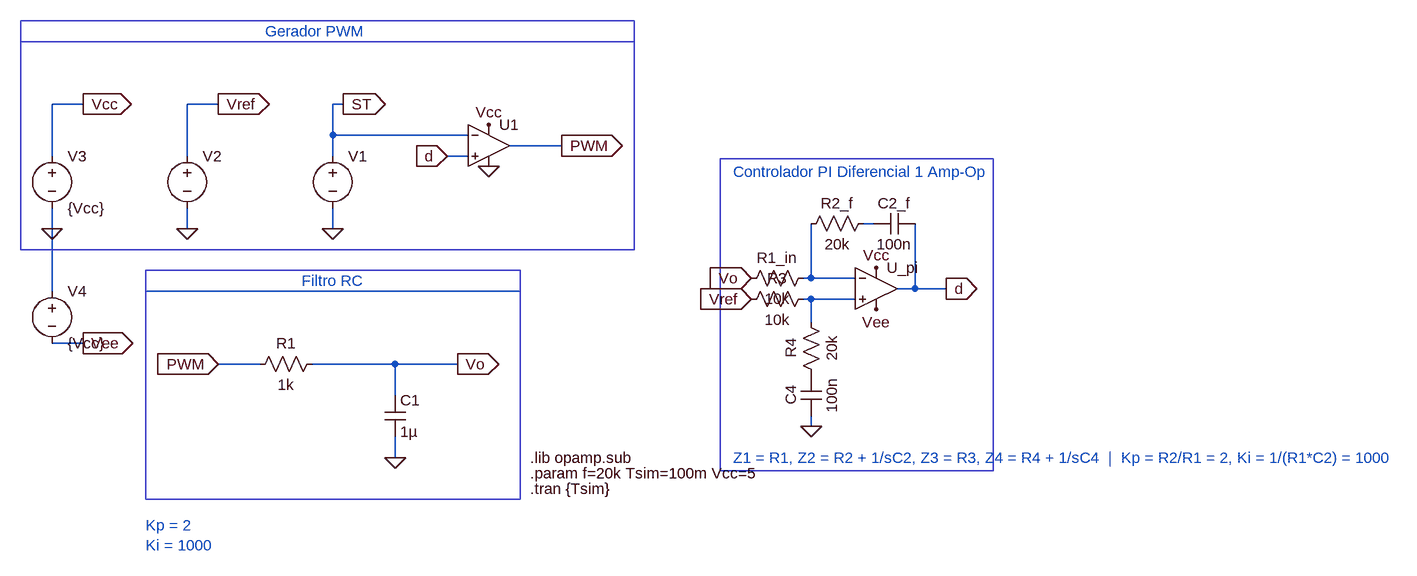
[diagram p0: schematic PI_alunos_1opamp.asc]
PI_alunos_1opamp.asc, the LTspice schematic file:
Version 4.1
SHEET 1 2332 1412
WIRE -320 16 -368 16
WIRE -112 16 -160 16
WIRE 80 16 64 16
WIRE 64 64 64 16
WIRE 272 64 64 64
WIRE 416 80 336 80
WIRE -368 96 -368 16
WIRE -160 96 -160 16
WIRE 64 96 64 64
WIRE 272 96 240 96
WIRE 896 200 880 200
WIRE -368 208 -368 176
WIRE -160 208 -160 176
WIRE 64 208 64 176
WIRE 800 284 800 200
WIRE 800 284 788 284
WIRE 868 284 800 284
WIRE 960 300 960 200
WIRE 960 300 932 300
WIRE 1008 300 960 300
WIRE -368 304 -368 208
WIRE 352 304 -224 304
WIRE 800 316 788 316
WIRE 868 316 800 316
WIRE 800 352 800 316
WIRE -320 384 -368 384
WIRE -48 416 -112 416
WIRE 160 416 32 416
WIRE 256 416 160 416
WIRE 160 464 160 416
WIRE 800 512 800 496
WIRE 160 560 160 528
FLAG 64 208 0
FLAG 80 16 ST
IOPIN 80 16 Out
FLAG 304 112 0
FLAG 240 96 d
IOPIN 240 96 In
FLAG 416 80 PWM
IOPIN 416 80 Out
FLAG -160 208 0
FLAG -112 16 Vref
IOPIN -112 16 Out
FLAG 160 560 0
FLAG -112 416 PWM
IOPIN -112 416 In
FLAG 256 416 Vo
IOPIN 256 416 Out
FLAG -368 208 0
FLAG -320 16 Vcc
IOPIN -320 16 Out
FLAG 304 48 Vcc
FLAG -320 384 Vee
IOPIN -320 384 Out
FLAG 708 316 Vref
IOPIN 708 316 In
FLAG 708 284 Vo
IOPIN 708 284 In
FLAG 800 512 0
FLAG 900 268 Vcc
FLAG 900 332 Vee
FLAG 1008 300 d
IOPIN 1008 300 Out
SYMBOL voltage 64 80 R0
WINDOW 3 24 96 Invisible 2
WINDOW 123 0 0 Left 0
WINDOW 39 0 0 Left 0
SYMATTR Value PULSE(0 5 0 {0.999/f} {0.001/f} 0 {1/f})
SYMATTR InstName V1
SYMBOL Opamps\\UniversalOpamp2 304 80 R0
SYMATTR InstName U1
SYMBOL voltage -160 80 R0
WINDOW 3 24 96 Invisible 2
WINDOW 123 0 0 Left 0
WINDOW 39 0 0 Left 0
SYMATTR Value PWL(0 {Vcc/4} {Tsim/4} {Vcc/4} {1.0001*Tsim/4} {Vcc/2} {Tsim/2} {Vcc/2} {1.0001*Tsim/2} 0 {3*Tsim/4} 0 {3.0001*Tsim/4} {3*Vcc/4})
SYMATTR InstName V2
SYMBOL cap 144 464 R0
SYMATTR InstName C1
SYMATTR Value 1µ
SYMBOL res 48 400 R90
WINDOW 0 0 56 VBottom 2
WINDOW 3 32 56 VTop 2
SYMATTR InstName R1
SYMATTR Value 1k
SYMBOL voltage -368 80 R0
WINDOW 123 0 0 Left 0
WINDOW 39 0 0 Left 0
SYMATTR InstName V3
SYMATTR Value {Vcc}
SYMBOL voltage -368 288 R0
WINDOW 123 0 0 Left 0
WINDOW 39 0 0 Left 0
SYMATTR InstName V4
SYMATTR Value {Vcc}
SYMBOL Opamps\\UniversalOpamp2 900 300 R0
SYMATTR InstName U_pi
SYMBOL res 804 268 R90
WINDOW 0 0 56 VBottom 2
WINDOW 3 32 56 VTop 2
SYMATTR InstName R1_in
SYMATTR Value 10k
SYMBOL res 896 184 R90
WINDOW 0 0 56 VBottom 2
WINDOW 3 32 56 VTop 2
SYMATTR InstName R2_f
SYMATTR Value 20k
SYMBOL cap 960 184 R90
WINDOW 0 0 32 VBottom 2
WINDOW 3 32 32 VTop 2
SYMATTR InstName C2_f
SYMATTR Value 100n
SYMBOL res 804 300 R90
WINDOW 0 0 56 VBottom 2
WINDOW 3 32 56 VTop 2
SYMATTR InstName R3
SYMATTR Value 10k
SYMBOL res 784 336 R0
WINDOW 0 0 56 VBottom 2
WINDOW 3 32 56 VTop 2
SYMATTR InstName R4
SYMATTR Value 20k
SYMBOL cap 784 432 R0
WINDOW 0 0 32 VBottom 2
WINDOW 3 32 32 VTop 2
SYMATTR InstName C4
SYMATTR Value 100n
TEXT 368 608 Left 2 !.tran {Tsim}
TEXT 368 584 Left 2 !.param f=20k Tsim=100m Vcc=5
TEXT -40 -96 Left 2 ;Gerador PWM
TEXT 16 288 Left 2 ;Filtro RC
TEXT -224 664 Left 2 ;Kp = 2\nKi = 1000
TEXT 368 560 Left 2 !.lib opamp.sub
TEXT 680 120 Left 2 ;Controlador PI Diferencial 1 Amp-Op
TEXT 680 560 Left 2 ;Z1 = R1, Z2 = R2 + 1/sC2, Z3 = R3, Z4 = R4 + 1/sC4  |  Kp = R2/R1 = 2, Ki = 1/(R1*C2) = 1000
LINE Normal -416 -80 528 -80
RECTANGLE Normal 352 624 -224 272
RECTANGLE Normal -416 240 528 -112
RECTANGLE Normal 1080 580 660 100

The netlist it stands for:
* PI_alunos_1opamp.asc
V1 ST 0 PULSE(0 5 0 {0.999/f} {0.001/f} 0 {1/f})
X§U1 d ST Vcc 0 PWM level.2 Avol=1Meg GBW=10Meg Slew=10Meg ilimit=25m rail=0 Vos=0 phimargin=45 en=0 enk=0 in=0 ink=0 Rin=500Meg  ; pins IN+ IN- V+ V- OUT
V2 Vref 0 PWL(0 {Vcc/4} {Tsim/4} {Vcc/4} {1.0001*Tsim/4} {Vcc/2} {Tsim/2} {Vcc/2} {1.0001*Tsim/2} 0 {3*Tsim/4} 0 {3.0001*Tsim/4} {3*Vcc/4})
C1 Vo 0 1µ
R1 Vo PWM 1k
V3 Vcc 0 {Vcc}
V4 0 Vee {Vcc}
X§U_pi N004 N002 Vcc Vee d level.2 Avol=1Meg GBW=10Meg Slew=10Meg ilimit=25m rail=0 Vos=0 phimargin=45 en=0 enk=0 in=0 ink=0 Rin=500Meg  ; pins IN+ IN- V+ V- OUT
R1_in N002 Vo 10k
R2_f N001 N002 20k
C2_f d N001 100n
R3 N004 Vref 10k
R4 N004 P001 20k
C4 P001 0 100n
.tran {Tsim}
.param f=20k Tsim=100m Vcc=5
* Gerador PWM
* Filtro RC
* Kp = 2
* Ki = 1000
.lib opamp.sub
* Controlador PI Diferencial 1 Amp-Op
* Z1 = R1, Z2 = R2 + 1/sC2, Z3 = R3, Z4 = R4 + 1/sC4  |  Kp = R2/R1 = 2, Ki = 1/(R1*C2) = 1000
.lib UniversalOpamps2.sub
.backanno
.end